# EAGLE design ahrs (EAGLE 7.6.0)
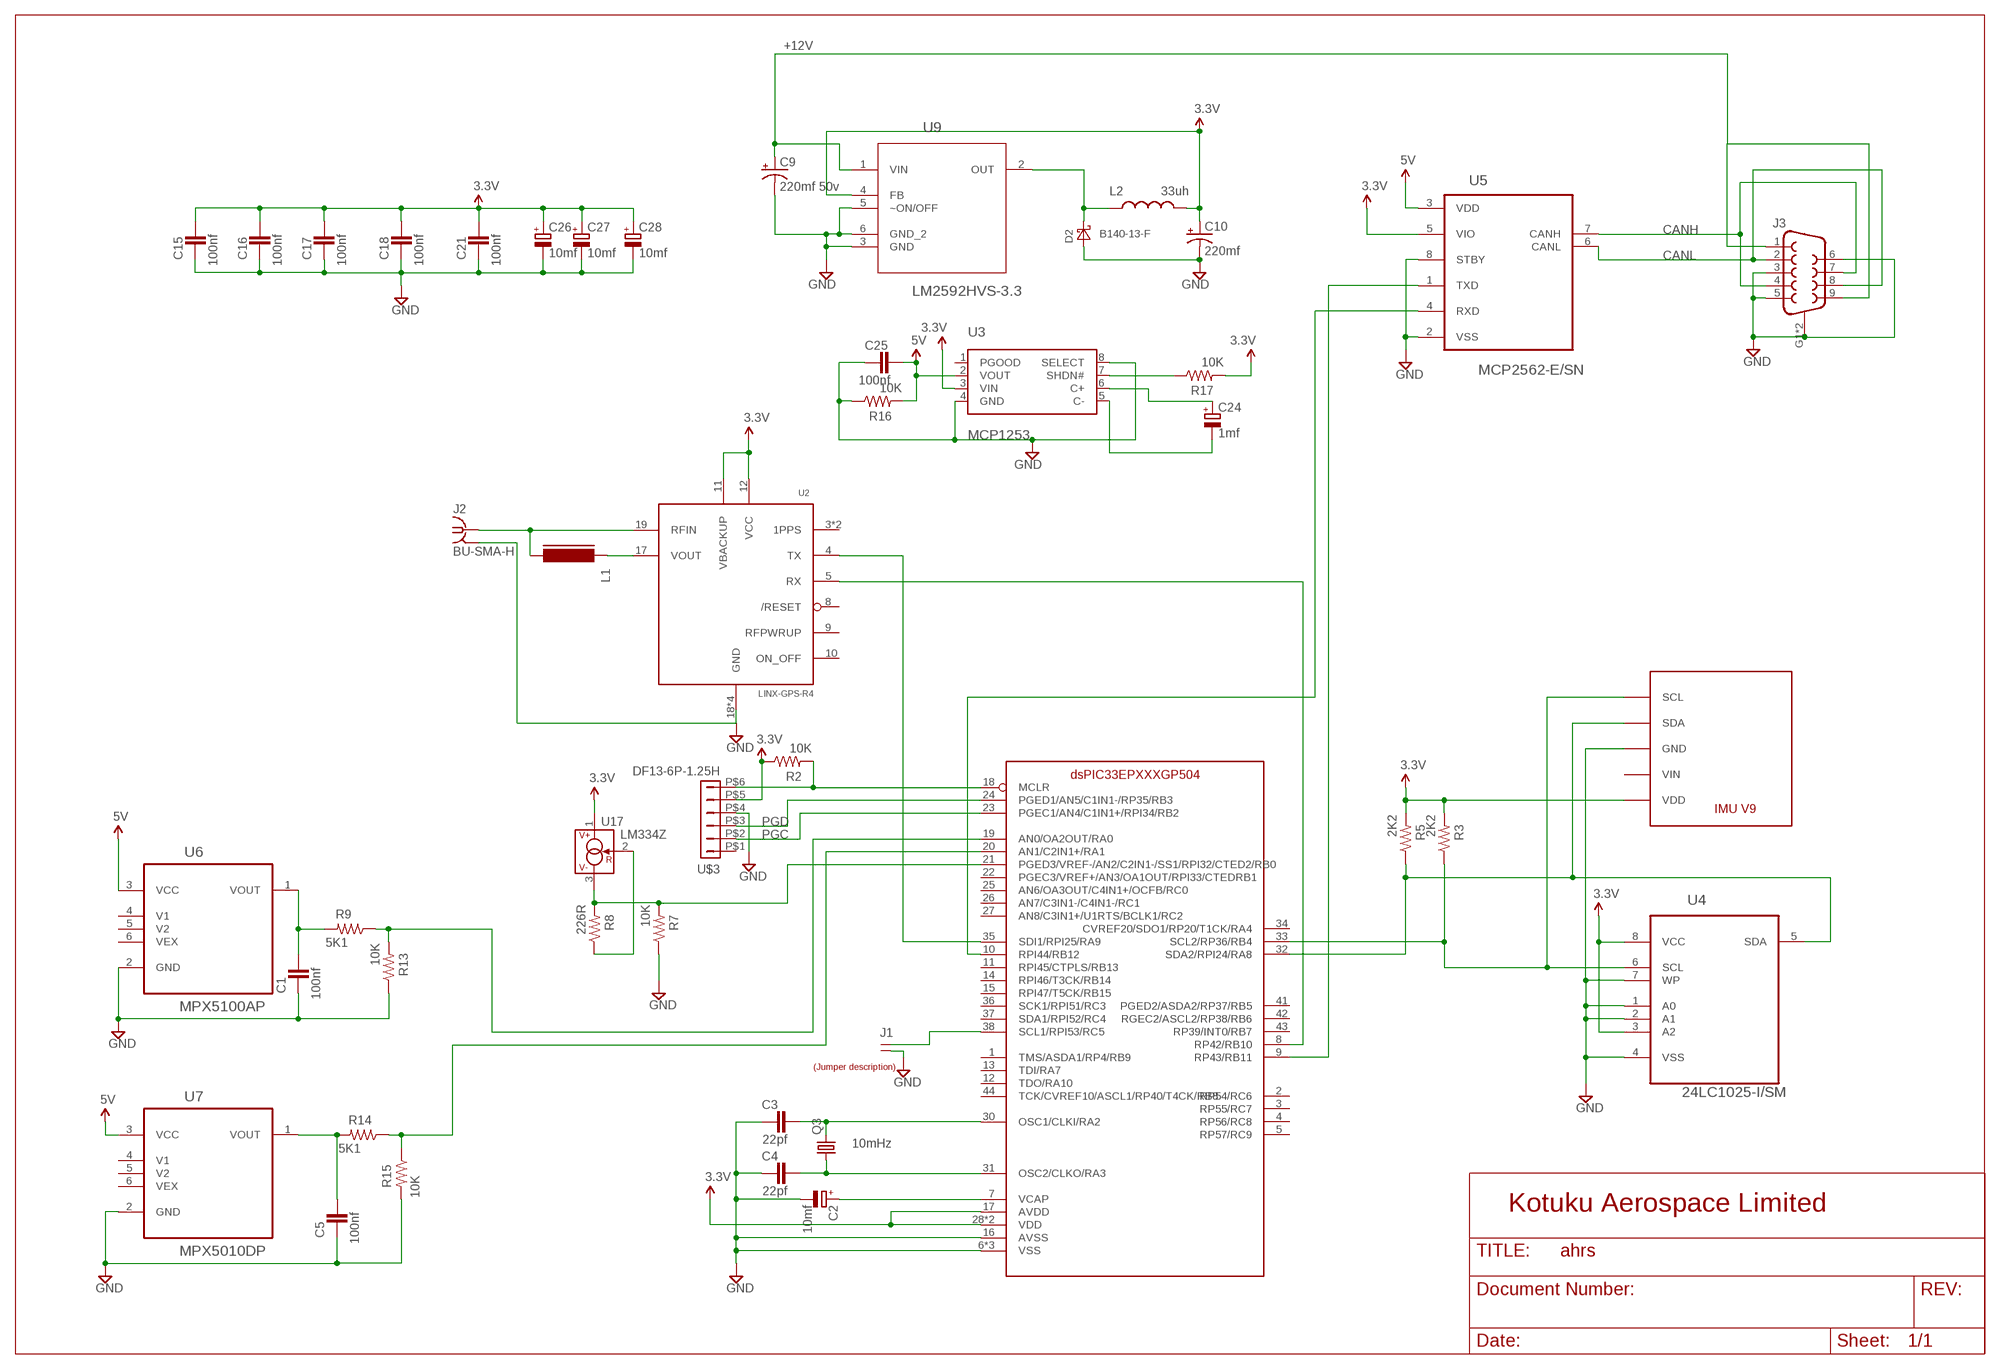
[diagram p0: schematic, sheet 1]

## Parts
C1  100nf  CAPACITOR_NPOL-0805  [C805]
C2  10mf  CAPACITOR_POL-SMC_A  [SMC_A]
C3  22pf  CAPACITOR_NPOL-0805  [C805]
C4  22pf  CAPACITOR_NPOL-0805  [C805]
C5  100nf  CAPACITOR_NPOL-0805  [C805]
C9  220mf 50v  CAP_POL7343  [EIA7343]
C10  220mf  CAP_POL7343  [EIA7343]
C15  100nf  CAPACITOR_NPOL-0805  [C805]
C16  100nf  CAPACITOR_NPOL-0805  [C805]
C17  100nf  CAPACITOR_NPOL-0805  [C805]
C18  100nf  CAPACITOR_NPOL-0805  [C805]
C21  100nf  CAPACITOR_NPOL-0805  [C805]
C24  1mf  CAPACITOR_POL-SMC_A  [SMC_A]
C25  100nf  CAPACITOR_NPOL-0805  [C805]
C26  10mf  CAPACITOR_POL-SMC_A  [SMC_A]
C27  10mf  CAPACITOR_POL-SMC_A  [SMC_A]
C28  10mf  CAPACITOR_POL-SMC_A  [SMC_A]
D2  B140-13-F  DIODE-SCHOTTKY-SMA  [SMA]
J1  JUMPER-1X2  [JUMPER-1X2]
J2  BU-SMA-H  [BU-SMA-H]
J3  DB9FEMALE  [DB9]
L1  FERRITE-PTH-10  [L10]
L2  33uh  INDUCTOR  [1812]
Q3  10mHz  CRYSTALHC49S  [HC49/S]
R2  10K  RESISTOR0603-RES  [0603-RES]
R3  2K2  RESISTOR0603-RES  [0603-RES]
R5  2K2  RESISTOR0603-RES  [0603-RES]
R7  10K  RESISTOR0603-RES  [0603-RES]
R8  226R  RESISTOR0603-RES  [0603-RES]
R9  5K1  RESISTOR0603-RES  [0603-RES]
R13  10K  RESISTOR0603-RES  [0603-RES]
R14  5K1  RESISTOR0603-RES  [0603-RES]
R15  10K  RESISTOR0603-RES  [0603-RES]
R16  10K  RESISTOR0603-RES  [0603-RES]
R17  10K  RESISTOR0603-RES  [0603-RES]
U1  DSPIC33EPXXXGP504  [TQFP44]
U2  LINX-GPS-R4  [LINX-R4]
U3  MCP1253  [MSOP8]
U4  24LC1025-I/SM  [SOIC8-N_MC]
U5  MCP2562-E/SN  [SOIC-8N]
U6  MPX5100AP  [FREESCALE_CASE_867B-04]
U7  MPX5010DP  MPX5100AP  [FREESCALE_CASE_867B-04]
U8  IMUV9  [IMUV9]
U9  LM2592HVS-3.3  LM2592HVS-5.0  [TO170P1435X457-5N]
U17  LM334Z  LM234Z  [TO92]
U$1  LABEL_JUMPER_1X2  [JUMP2_DESC]
U$3  DF13-6P-1.25H  [DF13A-6P-1.25H]

## Nets
3.3V: C10.A(+) C15.1 C16.1 C17.1 C18.1 C21.1 C26.+ C27.+ C28.+ L2.2 R2.1 R3.2 R5.2 R17.2 U1.17(AVDD) U1.28(VDD) U1.40(VDD) U2.11(VBACKUP) U2.12(VCC) U3.3(VIN) U4.3(A2) U4.8(VCC) U5.5(VIO) U8.VDD U9.4(FB) U17.1(V+) U$3.P$5
5V: C25.1 R16.2 U3.2(VOUT) U5.3(VDD) U6.3(VCC) U7.3(VCC)
!MCLR: R2.2 U1.18(MCLR) U$3.P$6
+12V: C9.A(+) J3.1 J3.9 U9.1(VIN)
CANH: J3.4 J3.7 U5.7(CANH)
CANL: J3.2 J3.8 U5.6(CANL)
GND: C1.2 C2.- C3.2 C4.2 C5.2 C9.C(-) C10.C(-) C15.2 C16.2 C17.2 C18.2 C21.2 C25.2 C26.- C27.- C28.- D2.A J1.2 J2.2 J2.3 J2.4 J2.5 J3.3 J3.5 J3.6 J3.G1(SHIELD) J3.G2(SHIELD) R7.1 R13.1 R15.2 R16.1 U1.6(VSS) U1.16(AVSS) U1.29(VSS) U1.39(VSS) U2.18(GND) U2.20(GND) U2.21(GND) U2.22(GND) U3.4(GND) U3.8(SELECT) U4.1(A0) U4.2(A1) U4.4(VSS) U4.7(WP) U5.2(VSS) U5.8(STBY) U6.2(GND) U7.2(GND) U8.GND U9.3(GND) U9.5(~ON/OFF) U9.6(GND_2) U$3.P$4
N$1: L1.1 U2.17(VOUT)
N$2: J2.1 L1.2 U2.19(RFIN)
N$4: C2.+ U1.7(VCAP)
N$5: C3.1 Q3.2 U1.30(OSC1/CLKI/RA2)
N$6: R9.1 R13.2 U1.19(AN0/OA2OUT/RA0)
N$7: C1.1 R9.2 U6.1(VOUT)
N$8: R5.1 U1.32(SDA2/RPI24/RA8) U4.5(SDA) U8.SDA
N$9: R3.1 U1.33(SCL2/RP36/RB4) U4.6(SCL) U8.SCL
N$11: C5.1 R14.2 U7.1(VOUT)
N$12: D2.C L2.1 U9.2(OUT)
N$14: R7.2 R8.2 U1.21(PGED3/VREF-/AN2/C2IN1-/SS1/RPI32/CTED2/RB0) U17.3(V-)
N$16: U1.35(SDI1/RPI25/RA9) U2.4(TX)
N$20: U1.8(RP42/RB10) U2.5(RX)
N$22: R8.1 U17.2(R)
N$24: U1.10(RPI44/RB12) U5.4(RXD)
N$25: J1.1 U1.38(SCL1/RPI53/RC5)
N$26: U1.9(RP43/RB11) U5.1(TXD)
N$36: R17.1 U3.7(SHDN#)
N$37: C24.- U3.5(C-)
N$38: C24.+ U3.6(C+)
N$70: C4.1 Q3.1 U1.31(OSC2/CLKO/RA3)
PGC: U1.23(PGEC1/AN4/C1IN1+/RPI34/RB2) U$3.P$2
PGD: U1.24(PGED1/AN5/C1IN1-/RP35/RB3) U$3.P$3
PITOT: R14.1 R15.1 U1.20(AN1/C2IN1+/RA1)
Unconnected: U1.1(TMS/ASDA1/RP4/RB9) U1.2(RP54/RC6) U1.3(RP55/RC7) U1.4(RP56/RC8) U1.5(RP57/RC9) U1.11(RPI45/CTPLS/RB13) U1.12(TDO/RA10) U1.13(TDI/RA7) U1.14(RPI46/T3CK/RB14) U1.15(RPI47/T5CK/RB15) U1.22(PGEC3/VREF+/AN3/OA1OUT/RPI33/CTEDRB1) U1.25(AN6/OA3OUT/C4IN1+/OCFB/RC0) U1.26(AN7/C3IN1-/C4IN1-/RC1) U1.27(AN8/C3IN1+/U1RTS/BCLK1/RC2) U1.34(CVREF20/SDO1/RP20/T1CK/RA4) U1.36(SCK1/RPI51/RC3) U1.37(SDA1/RPI52/RC4) U1.41(PGED2/ASDA2/RP37/RB5) U1.42(RGEC2/ASCL2/RP38/RB6) U1.43(RP39/INT0/RB7) U1.44(TCK/CVREF10/ASCL1/RP40/T4CK/RB8) U2.3(1PPS) U2.7(1PPS) U2.8(/RESET) U2.9(RFPWRUP) U2.10(ON_OFF) U3.1(PGOOD) U6.4(V1) U6.5(V2) U6.6(VEX) U7.4(V1) U7.5(V2) U7.6(VEX) U$3.P$1

## Notes on the sheet
- Kotuku Aerospace Limited

## Power pins joined to a net without a drawn wire
VIN: U8.VIN

## Library data of the parts
C1 C3-C5 C15-C18 C21 C25 = dp_devices:CAPACITOR_NPOL: Non-Polarized capacitor in various packages
C2 C24 C26-C28 = dp_devices:CAPACITOR_POL: Polarized capacitor in various packages
C9 C10 = SparkFun:CAP_POL: Capacitor Polarized These are standard SMD and PTH capacitors. Normally 10uF, 47uF, and 100uF in electrolytic and tantalum varieties. Always verify the external diameter of the through hole cap, it varies with capacity, voltage, and manufacturer. The EIA devices should be standard.
D2 = diode2:DIODE-SCHOTTKY-: SCHOTTKY DIODE
J1 = QuantumOptics:JUMPER-1X2: Jumper, header, SIP on 0.1" grid, for option selection.
J2 = con-coax:BU-SMA-H: FEMALE SMA CONNECTOR Radiall; OC_FARNELL: unknown; OC_NEWARK: unknown; PARTNO: 5-1814400-1
J3 = SparkFun-Connectors:DB9: DB9 Connector Standard DB9 (D-Sub 9) serial connector. Can be used for CAN bus as well as RS485 and RS232. Footprint production proven. Spark Fun Electronics SKU : PRT-00429; PARTNO: 1734354-2; PROD_ID: CONN-08194
L1 = dp_devices:FERRITE: Ferrite bead in various packages; PARTNO: BL01RN1A1D2B
L2 = SparkFun:INDUCTOR: Inductors Basic Inductor/Choke - 0603 and 1206. Footprints are not proven and vary greatly between part numbers.
Q3 = crystal:CRYSTAL: CRYSTAL; OC_FARNELL: 1667008; OC_NEWARK: unknown; PARTNO: 9B-10.000MBBK-B
R2 R3 R5 R7-R9 R13-R17 = SparkFun-Passives:RESISTOR: Resistor Basic schematic elements and footprints for 0603, 1206, and PTH resistors.; PARTNO: ERJ-3GEYJ103V
U1 = microchip-dspic:DSPIC33EPXXXGP504
U2 = Supernode-Sensors:LINX-GPS-R4; PARTNO: RXM-GPS-R4-T
U3 = microchip-dspic:MCP1253: Positive-Regulated Charge Pump (3.3x5.0)
U4 = Microchip_By_element14_Batch_1:24LC1025-I/SM: 1024K I2C CMOS Serial EEPROM
U5 = Microchip-MCP2562-E_SN:MCP2562-E/SN: High-Speed CAN Transceiver,SOIC-8
U6 U7 = MPX5100AP:MPX5100AP: IC, PRESSURE SENSOR, 0 TO 100KPA, SIP-6; MPN: MPX5100AP; OC_FARNELL: 1457156; OC_NEWARK: 07F9928; PACKAGE: CASE 867B-04; SUPPLIER: FREESCALE SEMICONDUCTOR
U8 = POLULU:IMUV9
U9 = NSC_By_element14_Batch_1.1:LM2592HVS-5.0: SIMPLE SWITCHER; MPN: LM2592HVS-5.0; OC_FARNELL: -; OC_NEWARK: 41K3791; PACKAGE: TO-263-5; SUPPLIER: National Semiconductor
U17 = linear:LM*34: 3-Terminal Adjustable Current Sources Source: www.national.com/pf/LM/LM334.html | LM134.pdf; PARTNO: LM334Z/NOPB
U$1 = dp_devices:LABEL_JUMPER_1X2: Nice formatted two legged jumperdescription Use attributes to change the values ON = With jumper OFF = Without jumper; OFF: Normal; ON: Reset
U$3 = con-hirose-df13:DF13-6P-1.25: DF13-6P 1.25mm Pitch Miniature Crimping Connector.

## Net classes
0 default: width 0.152 mm, drill 0.305 mm, clearance 0.152 mm
2 12v: width 1.27 mm, drill 0.305 mm, clearance 0.305 mm

## Board
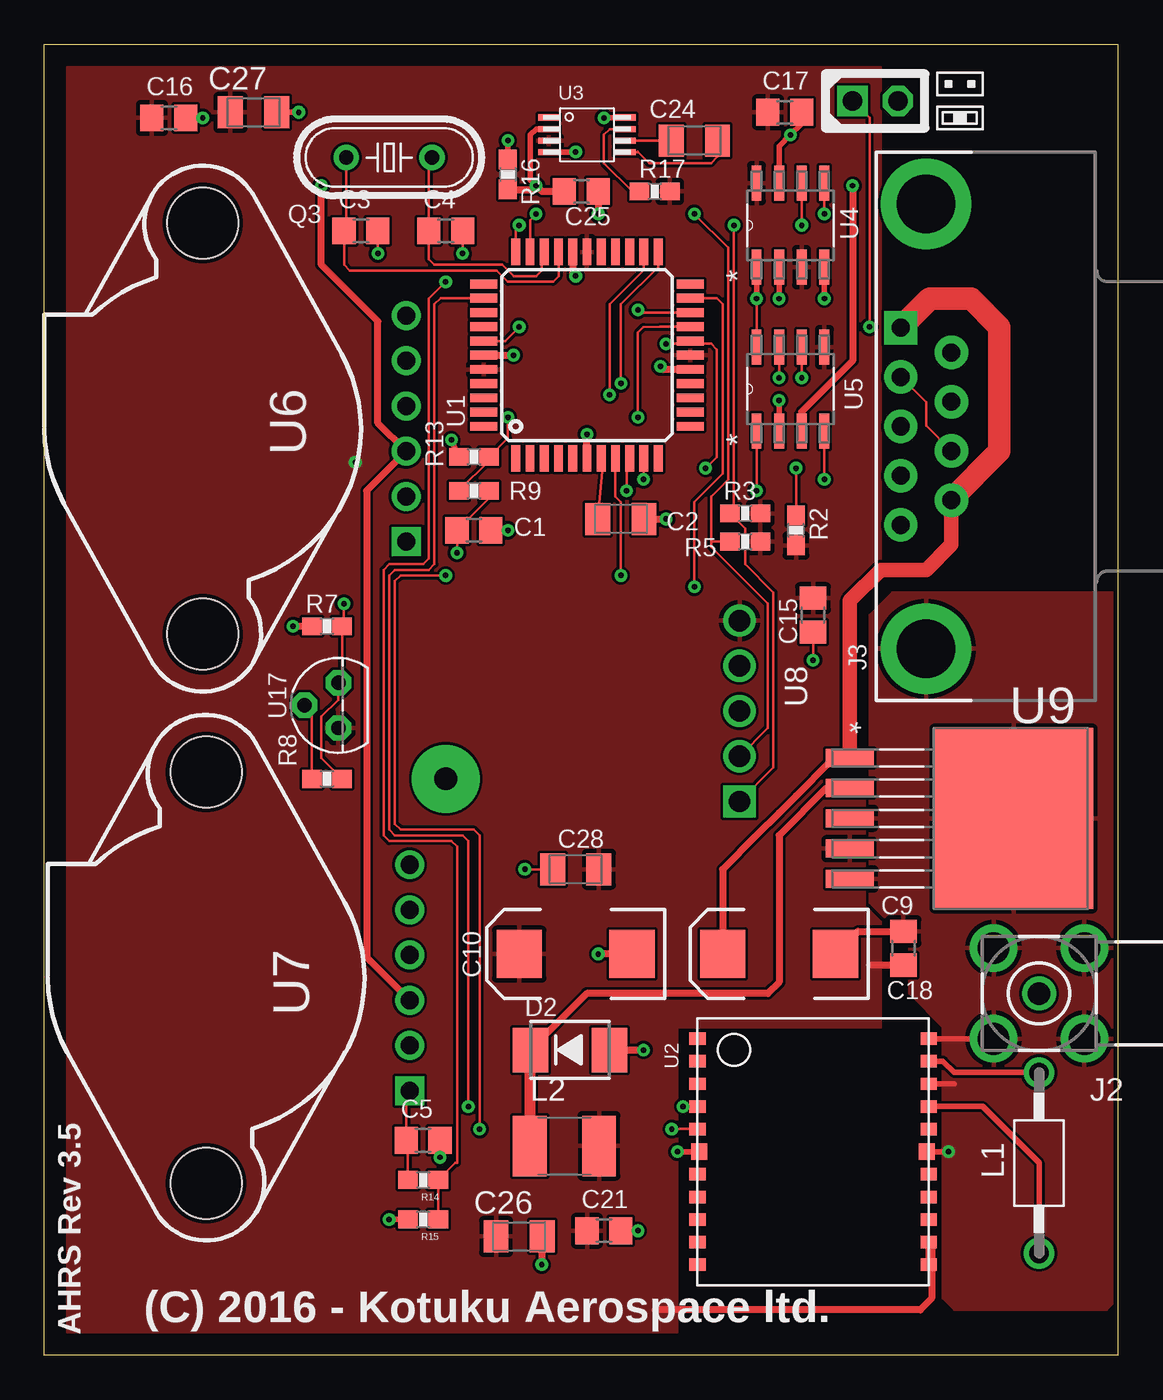
[diagram p1: board, top side]
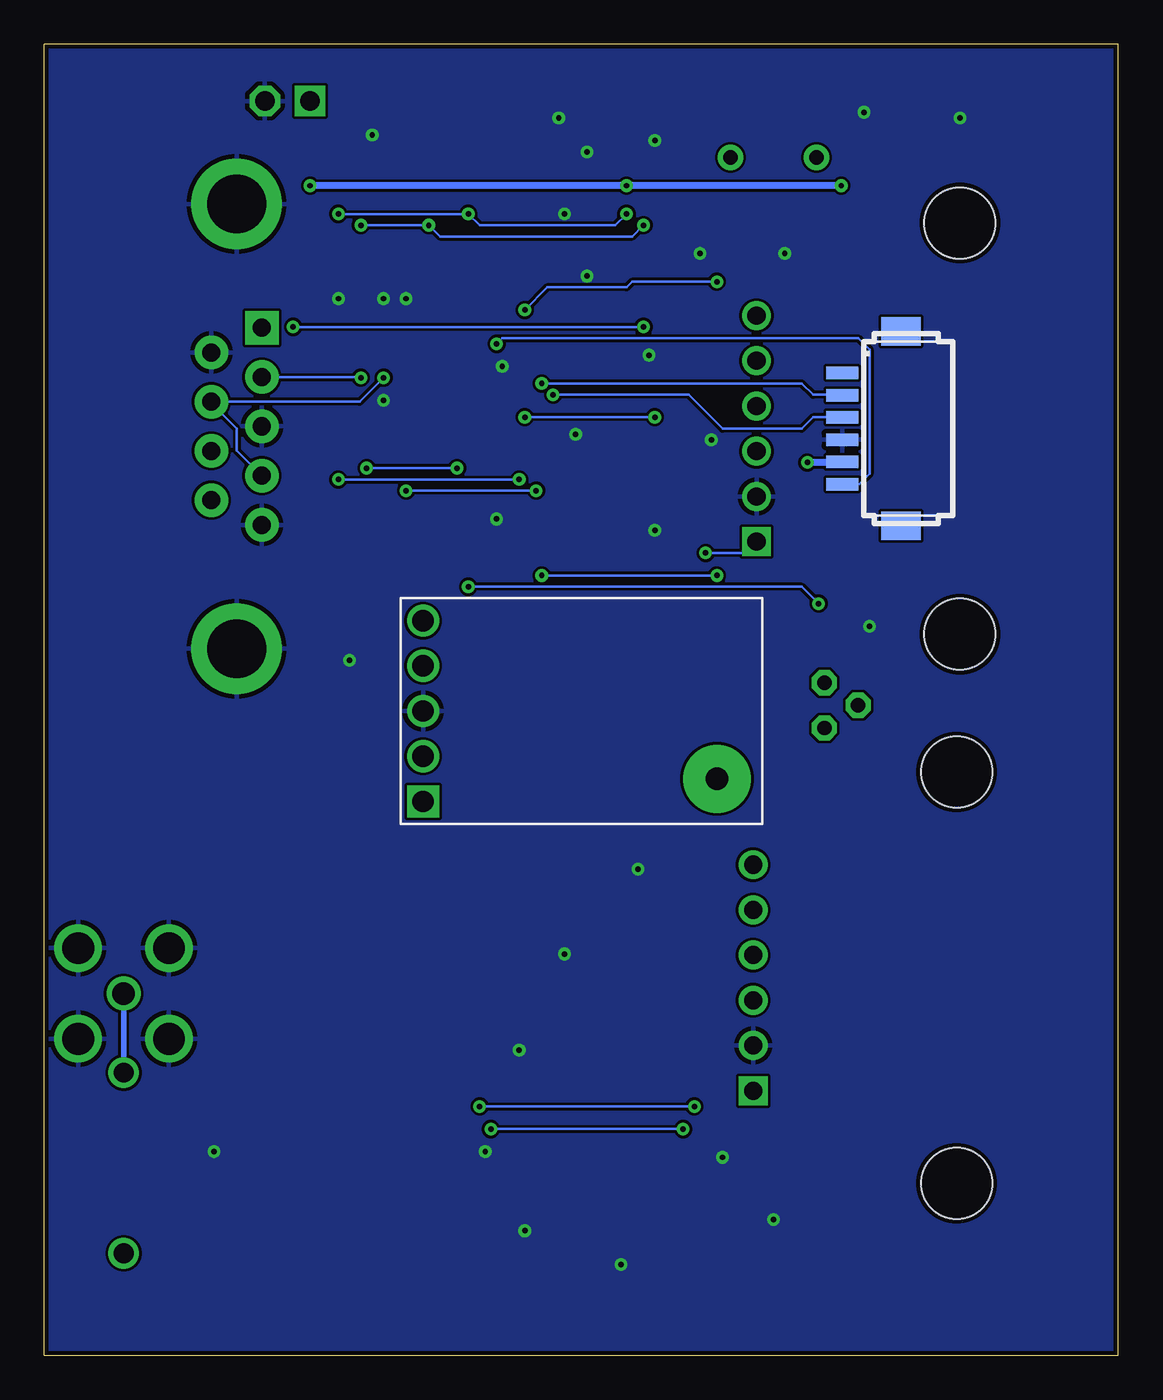
[diagram p2: board, bottom side, seen from below]

Size 60.33 x 73.66 mm. Coordinates in mm from the lower left corner, seen from the top.
Outline: 60.33,0 0,0 0,73.66 60.33,73.66 60.33,0
Copper layers (1*16): Top 0.035mm / dielectric 1.5mm / Bottom 0.035mm
Design rules "DFRobot_Eagle_Rule_v0.4": minimum track width 6mil, minimum drill 12mil, track to track 6mil, track to pad 6mil, pad to pad 6mil, via to via 6mil, smd to smd 0mil, copper to edge 10mil, drill to drill 10mil, minimum pad ring 12mil, minimum via ring 8mil, stop-mask expansion 2mil, vias tented up to drill 25mil, thermal gap 10mil

### Footprints (pad centres in the part's own frame; a part is rotated, then mirrored left to right if it is on the bottom)
C805 = smd 1.3 x 1.5: 1 -0.95,0; 2 0.95,0
SMC_A = smd 1.4 x 1.8: + -1.3,0; - 1.3,0
EIA7343 = smd 2.55 x 2.7: A 3.17,0; C -3.17,0
SMA = smd 2 x 2.5: A 2.223,0; C -2.223,0
JUMPER-1X2 = drill 1.092 square: 1 0,2.54 | drill 1.092 octagon: 2 0,0
BU-SMA-H = drill 1.27: 1 0,0 | drill 1.778: 2 -2.55,2.55; 3 2.55,2.55; 4 2.55,-2.55; 5 -2.55,-2.55
DB9 = drill 1.016 pad 1.88 square: 1 -5.54,-1.42 | drill 1.016 pad 1.88: 2 -2.77,-1.42; 3 0,-1.42; 4 2.77,-1.42; 5 5.54,-1.42; 6 -4.15,1.42; 7 -1.38,1.42; 8 1.38,1.42; 9 4.15,1.42 | drill 3.302 pad 5.08: G1 -12.5,0; G2 12.5,0
L10 = drill 1.118: 1 -5.08,0; 2 5.08,0
1812 = smd 1.9 x 3.4: 1 -1.95,0; 2 1.95,0
HC49/S = drill 0.813: 1 -2.413,0; 2 2.413,0
0603-RES = smd 1.1 x 1: 1 -0.85,0; 2 0.85,0
TQFP44 = smd 1.5 x 0.5: 1 -5.8,4; 2 -5.8,3.2; 3 -5.8,2.4; 4 -5.8,1.6; 5 -5.8,0.8; 6 -5.8,0; 7 -5.8,-0.8; 8 -5.8,-1.6; 9 -5.8,-2.4; 10 -5.8,-3.2; 11 -5.8,-4; 23 5.8,-4; 24 5.8,-3.2; 25 5.8,-2.4; 26 5.8,-1.6; 27 5.8,-0.8; 28 5.8,0; 29 5.8,0.8; 30 5.8,1.6; 31 5.8,2.4; 32 5.8,3.2; 33 5.8,4 | smd 0.5 x 1.5: 12 -4,-5.8; 13 -3.2,-5.8; 14 -2.4,-5.8; 15 -1.6,-5.8; 16 -0.8,-5.8; 17 0,-5.8; 18 0.8,-5.8; 19 1.6,-5.8; 20 2.4,-5.8; 21 3.2,-5.8; 22 4,-5.8; 34 4,5.8; 35 3.2,5.8; 36 2.4,5.8; 37 1.6,5.8; 38 0.8,5.8; 39 0,5.8; 40 -0.8,5.8; 41 -1.6,5.8; 42 -2.4,5.8; 43 -3.2,5.8; 44 -4,5.8
LINX-R4 = smd 0.7 x 0.92: 1 -6.35,-6.5; 2 -5.08,-6.5; 3 -3.81,-6.5; 4 -2.54,-6.5; 5 -1.27,-6.5; 6 1.27,-6.5; 7 2.54,-6.5; 8 3.81,-6.5; 9 5.08,-6.5; 10 6.35,-6.5; 11 6.35,6.5; 12 5.08,6.5; 13 3.81,6.5; 14 2.54,6.5; 15 1.27,6.5; 16 -1.27,6.5; 17 -2.54,6.5; 18 -3.81,6.5; 19 -5.08,6.5; 20 -6.35,6.5 | smd 0.92 x 0.92: 21 0,-6.39; 22 0,6.39
MSOP8 = smd 1.2 x 0.35: 1 -2.145,0.975; 2 -2.145,0.325; 3 -2.145,-0.325; 4 -2.145,-0.975; 5 2.145,-0.975; 6 2.145,-0.325; 7 2.145,0.325; 8 2.145,0.975
SOIC8-N_MC = smd 1.981 x 0.559: 1 -2.362,1.905; 2 -2.362,0.635; 3 -2.362,-0.635; 4 -2.362,-1.905; 5 2.362,-1.905; 6 2.362,-0.635; 7 2.362,0.635; 8 2.362,1.905
SOIC-8N = smd 1.981 x 0.559: 1 1.448,5.715; 2 1.448,4.445; 3 1.448,3.175; 4 1.448,1.905; 5 6.172,1.905; 6 6.172,3.175; 7 6.172,4.445; 8 6.172,5.715
FREESCALE_CASE_867B-04 = drill 1.016 square: 1 -12.7,2.54 | drill 1.016: 2 -10.16,2.54; 3 -7.62,2.54; 4 -5.08,2.54; 5 -2.54,2.54; 6 0,2.54 | hole 4: 5.205,13.97; -17.905,13.97
IMUV9 = drill 1.2: GND 0,-5.08; SDA 0,-2.54; VDD 0,-10.16; VIN 0,-7.62 | drill 1.27 pad 3.81: P$1 16.51,-1.27 | drill 1.2 square: SCL 0,0
TO170P1435X457-5N = smd 1.016 x 2.692: 1 -3.404,-9.042; 2 -1.702,-9.042; 3 0,-9.042; 4 1.702,-9.042; 5 3.404,-9.042 | smd 10.16 x 8.941: 6 0,0.152
TO92 = drill 0.813 octagon: 1 -1.27,0; 2 0,1.905; 3 1.27,0
DF13A-6P-1.25H = smd 1.6 x 2.2: M$0 -5.475,2.4; M$1 5.475,2.4 | smd 0.7 x 1.8: P$1 -3.125,-0.9; P$2 -1.875,-0.9; P$3 -0.625,-0.9; P$4 0.625,-0.9; P$5 1.875,-0.9; P$6 3.125,-0.9

### Placement (x,y rotation side)
C1  24.13,46.35 0 top
C2  32.38,46.99 0 top
C3  17.78,63.18 0 top
C4  22.54,63.18 0 top
C5  21.27,12.06 0 top
C9  41.27,22.54 180 top
C10  29.84,22.54 180 top
C15  43.18,41.59 270 top
C16  6.99,69.53 0 top
C17  41.59,69.85 0 top
C18  48.26,22.86 90 top
C21  31.43,6.99 0 top
C24  36.51,68.26 0 top
C25  30.16,65.41 0 top
C26  26.67,6.67 0 top
C27  11.75,69.85 0 top
C28  29.84,27.3 180 top
D2  29.53,17.14 0 top
J1  47.94,70.48 90 top
J2  55.88,20.32 0 top
J3  49.53,52.2 270 top
L1  55.88,10.79 90 top
L2  29.21,11.75 0 top
Q3  19.37,67.31 180 top
R2  42.23,46.35 90 top
R3  39.37,47.31 0 top
R5  39.37,45.72 0 top
R7  15.88,40.96 0 top
R8  15.88,32.38 0 top
R9  24.13,48.58 0 top
R13  24.13,50.48 0 top
R14  21.27,9.84 180 top
R15  21.27,7.62 180 top
R16  26.04,66.36 270 top
R17  34.29,65.41 0 top
U1  30.48,56.2 90 top
U2  43.18,11.43 270 top
U3  30.48,68.58 0 top
U4  41.91,63.5 90 top
U5  45.72,50.48 90 top
U6  22.86,58.42 90 top
U7  23.05,27.56 90 top
U8  39.05,31.11 180 top
U9  54.29,30.16 270 top
U17  16.51,36.51 90 top
U$1  53.98,70.17 0 top
U$3  14.61,52.07 270 bottom

### Tracks (layer width: path | path; a pad name or v marks a point on that pad's centre or on a via)
3.3V  (via drill 0.3)
  Top 0.406: C18.1 46.35,21.91 | U2.11 U2.12 49.85,6.18 49.85,3.17 49.21,2.54 34.29,2.54
  Bottom 0.406: U$3.P$5 15.54,50.16 v17.46,50.16
  pour Top (rank 2): 46.99,72.39 1.27,72.39 1.27,1.27 35.56,1.27 35.56,18.41 46.99,18.41
5V  (via drill 0.3)
  Top 0.305: U3.2 28.33,68.9 27.62,68.9 27.3,68.58 27.3,66.04 v27.62,65.72
  Top 0.406: v15.56,65.72 15.56,61.28 18.73,58.1 18.73,52.39 U6.3 18.1,48.58 18.1,22.35 U7.3 | v45.4,65.72 45.4,55.88 42.55,53.02 U5.3 | R16.2 27.41,65.51 v27.62,65.72 27.94,65.41 C25.1
  Bottom 0.406: v15.56,65.72 v27.62,65.72 v45.4,65.72
!MCLR  (via drill 0.3)
  Top 0.152: v37.15,49.85 37.78,50.48 37.78,56.52 37.47,56.83 36.45,56.83 U1.18 36.12,56.83 v34.92,56.83 | v42.23,49.85 R2.2
  Bottom 0.152: v37.15,49.85 v42.23,49.85 | v34.92,56.83 34.61,57.15 14.61,57.15 13.97,56.52 13.97,49.53 14.55,48.95 U$3.P$6
+12V
  Top 0.406: U9.1 45.02,33.34 44.13,33.34 42.23,31.43 41.27,30.48 40,29.2 38.1,27.3 38.1,23.5 C9.A
  Top 0.813: U9.1 45.25,42.39 46.99,44.13 49.53,44.13 50.95,45.55 J3.9
  Top 1.27: J3.1 49.74,59.37 52.07,59.37 53.66,57.78 53.66,50.8 50.95,48.09 J3.9
CANH  (via drill 0.3)
  Top 0.152: U5.7 v41.27,54.93
  Bottom 0.152: J3.4 49.53,50.85 49.53,52.07 50.95,53.49 J3.7 42.63,53.58 v41.27,54.93
CANL  (via drill 0.3)
  Top 0.152: J3.2 49.53,53.55 49.53,52.24 J3.8 | v42.55,54.93 U5.6
  Bottom 0.152: J3.2 42.58,54.97 v42.55,54.93
GND  (via drill 0.3)
  Top 0.152: C3.2 v18.73,61.91 | C4.2 v23.49,61.91 v23.5,61.91 | v40.01,59.37 U5.8 | C28.- v26.99,27.3 | C15.2 v43.18,39.05
  Top 0.305: U3.8 31.45,69.56 v31.43,69.53 | U3.4 29.82,67.61 v29.84,67.63 | R16.1 v26.04,68.26 | U4.7 41.27,67.94 v41.91,68.58 42.54,69.21 C17.2 | C27.- v14.29,69.85 | C16.2 v8.89,69.53 | U5.2 v41.27,53.66 | U4.1 v40.01,59.37 | U4.2 v41.27,59.37 | U4.4 v43.81,59.37 | R13.1 v22.86,51.44 | U2.21 v35.56,11.43 | U2.20 J2.5 | U2.18 51.12,15.24 | U2.22 v50.8,11.43 | C5.2 v22.23,11.11 | R15.2 v19.37,7.62
  Top 0.406: D2.A v33.66,17.14 | C10.C v31.11,22.54 | C1.2 v26.04,46.35 | R7.1 v13.97,40.96 | C2.- v34.92,46.99 | U1.6 v30.48,51.75 | U1.16 34.77,55.4 v34.61,55.56 | U1.39 v26.35,56.2 | U1.29 29.68,60.81 v29.84,60.64 | C25.2 v31.11,64.14 | C9.C 45.71,23.81 C18.2 | C21.2 v33.34,6.99 | C26.- 27.94,6.64 v27.94,5.08
  pour Top: 46.35,25.4 46.35,41.59 47.62,42.86 60.33,42.86 60.33,3.17 59.69,2.54 51.12,2.54 50.48,3.17 50.48,18.41 48.58,20.32 48.58,23.18
  pour Bottom: 0,73.66 60.96,73.66 60.96,0 0,0
N$1
  Top 0.305: U2.17 52.7,13.97 55.88,10.79 L1.1
N$2
  Top 0.305: U2.19 50.48,16.51 51.12,15.88 L1.2
  Bottom 0.305: L1.2 J2.1
N$4
  Top 0.152: U1.7 31.4,50.27 C2.+
N$5
  Top 0.152: U1.30 28.88,60.66 28.89,60.64 28.57,60.33 26.04,60.33 25.4,60.96 17.14,60.96 16.83,61.27 C3.1 16.95,63.31 Q3.2
N$6  (via drill 0.3)
  Top 0.152: R9.1 24.98,50.28 R13.2 26.04,51.54 v26.04,52.7 | v33.34,52.7 33.34,57.47 33.66,57.78 34.59,57.8 U1.19
  Bottom 0.152: v26.04,52.7 v33.34,52.7
N$7  (via drill 0.3)
  Top 0.152: v23.18,45.09 C1.1 24.98,48.16 R9.2
  Bottom 0.152: U6.1 20.95,45.09 v23.18,45.09
N$8  (via drill 0.3)
  Top 0.152: v36.51,64.14 38.42,62.23 38.42,49.21 37.47,48.26 37.47,45.72 | v27.62,64.14 27.28,63.79 U1.32 | U4.5 v43.81,64.14 | 38.92,45.32 R5.1 37.47,45.72 | 37.47,45.72 37.47,45.4 40.64,42.23 40.64,35.24 U8.SDA
  Bottom 0.152: v27.62,64.14 28.26,63.5 35.88,63.5 v36.51,64.14 v43.81,64.14
N$9  (via drill 0.3)
  Top 0.152: v38.73,63.5 38.73,47.62 38.52,47.41 R3.1 39.37,46.46 39.37,44.45 40.96,42.86 40.96,33.02 U8.SCL | v26.67,63.5 26.48,63.31 U1.33 | U4.6 v42.55,63.5
  Bottom 0.152: v26.67,63.5 27.3,62.87 38.1,62.87 v38.73,63.5 v42.55,63.5
N$11
  Top 0.152: U7.1 20.32,14.67 C5.1 20.42,11.96 R14.2
N$12
  Top 0.406: U9.2 43.93,31.86 41.27,29.21 41.27,20.95 40.64,20.32 30.48,20.32 D2.C
  Top 0.61: D2.C 27.26,17.1 L2.1
N$14  (via drill 0.3)
  Top 0.152: R8.2 15.56,33.55 15.56,35.88 16.51,36.83 U17.3 16.73,38 R7.2 16.83,41.06 v16.83,42.23 | v36.51,43.18 36.51,47.94 38.1,49.53 38.1,59.05 37.76,59.4 U1.21
  Bottom 0.152: v16.83,42.23 17.78,43.18 v36.51,43.18
N$16  (via drill 0.3)
  Top 0.152: U2.4 v35.88,13.97 | v23.81,13.97 23.81,28.89 23.5,29.21 19.68,29.21 19.37,29.53 19.37,43.81 19.68,44.13 21.59,44.13 21.91,44.45 21.91,59.05 22.25,59.4 U1.35
  Bottom 0.152: v35.88,13.97 v23.81,13.97
N$20  (via drill 0.3)
  Top 0.152: U2.5 v35.24,12.7 | v24.45,12.7 24.45,29.21 24.13,29.53 20,29.53 19.68,29.84 19.68,43.5 20,43.81 v22.54,43.81 | v32.38,43.81 32.38,47.94 32.08,48.25 U1.8
  Bottom 0.152: v35.24,12.7 v24.45,12.7 | v22.54,43.81 v32.38,43.81
N$22
  Top 0.152: U17.2 15.03,36.09 R8.1
N$24  (via drill 0.3)
  Top 0.152: U5.4 v43.81,49.21 | v33.66,49.21 33.68,49.24 U1.10
  Bottom 0.152: v43.81,49.21 v33.66,49.21
N$25  (via drill 0.3)
  Top 0.152: U1.38 25.88,57 v26.67,57.78 | v46.35,57.78 46.35,69.53 J1.1
  Bottom 0.152: v26.67,57.78 v46.35,57.78
N$26  (via drill 0.3)
  Top 0.152: U1.9 32.7,50.22 v32.7,48.58 | v40.01,48.58 U5.1
  Bottom 0.152: v32.7,48.58 v40.01,48.58
N$36
  Top 0.152: U3.7 32.62,68.9 31.75,68.9 31.43,68.58 31.43,66.99 33.02,65.41 R17.1
N$37
  Top 0.152: U3.5 33.31,67.61 33.34,67.63 33.97,66.99 37.47,66.99 37.81,67.34 C24.-
N$38
  Top 0.152: U3.6 32.63,68.26 C24.+
N$70
  Top 0.152: Q3.1 21.59,67.12 C4.1 21.59,61.59 21.91,61.28 25.72,61.28 26.35,60.64 27.62,60.64 27.94,60.96 27.94,61.86 U1.31
PGC  (via drill 0.3)
  Top 0.152: v32.38,54.61 32.38,59.05 34.48,61.15 U1.23
  Bottom 0.152: U$3.P$2 15.54,53.98 17.14,53.98 17.78,54.61 v32.38,54.61
PGD  (via drill 0.3)
  Top 0.152: v31.75,53.98 31.75,59.05 33.68,60.98 U1.24
  Bottom 0.152: U$3.P$3 17.14,52.7 17.78,52.07 22.23,52.07 24.13,53.98 v31.75,53.98
PITOT  (via drill 0.3)
  Top 0.152: R15.1 R14.1 23.07,10.79 23.18,10.79 23.18,28.57 22.86,28.89 19.37,28.89 19.05,29.21 19.05,44.13 19.37,44.45 21.27,44.45 21.59,44.77 21.59,59.37 v22.54,60.33 | v33.34,58.74 33.48,58.6 U1.20
  Bottom 0.152: v22.54,60.33 27.3,60.33 27.62,60.01 32.07,60.01 v33.34,58.74

### Text on the board
tPlace: (C) 2016 - Kotuku Aerospace ltd. | AHRS Rev 3.5